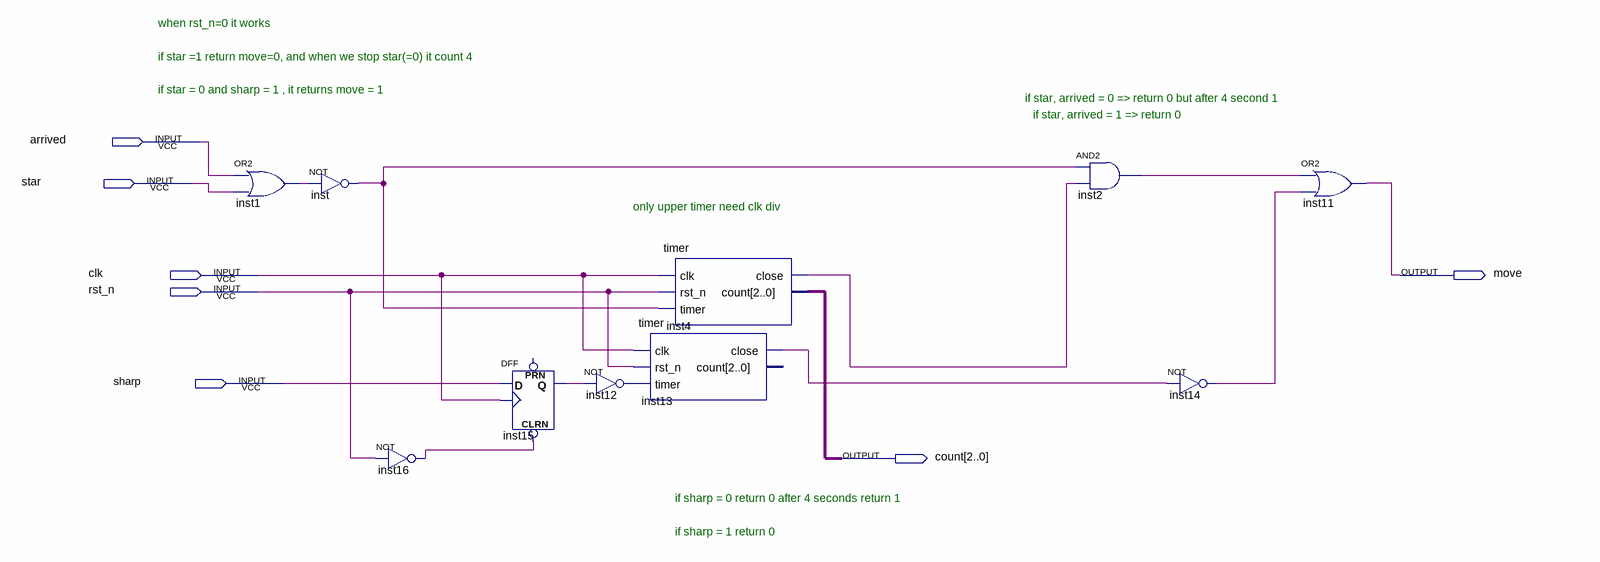
[diagram p0: schematic sheet]
// Quartus schematic canMove.bdf as structural Verilog: 10 symbols, 7 pins
module canMove (
  input  arrived,
  input  star,
  input  clk,
  input  rst_n,
  input  sharp,
  output move,
  output [2:0] count
);

  wire inst1_out, inst2_out, inst4_close, inst12_out, inst13_close, inst14_out, inst15_q, inst16_out,
       inst_out;

  or inst1 (inst1_out, arrived, star);
  not inst (inst_out, inst1_out);
  not inst16 (inst16_out, rst_n);
  DFF inst15 (.CLRN(inst16_out), .CLK(clk), .D(sharp), .Q(inst15_q));  // open: PRN
  timer inst13 (.clk(clk), .rst_n(rst_n), .timer(inst12_out), .close(inst13_close));  // open: count
  not inst12 (inst12_out, inst15_q);
  timer inst4 (.clk(clk), .rst_n(rst_n), .timer(inst_out), .close(inst4_close), .count(count));
  and inst2 (inst2_out, inst_out, inst4_close);
  not inst14 (inst14_out, inst13_close);
  or inst11 (move, inst2_out, inst14_out);

  // Notes on the sheet:
  //   when rst_n=0 it works
  //   if star =1 return move=0, and when we stop star(=0) it count 4
  //   if star = 0 and sharp = 1 , it returns move = 1
  //   if star, arrived = 0 => return 0 but after 4 second 1
  //   if star, arrived = 1 => return 0
  //   only upper timer need clk div
  //   if sharp = 0 return 0 after 4 seconds return 1
  //   if sharp = 1 return 0
endmodule
